# Altium project 100862_project.prjpcb (part 2 of 2)

## Sheet RevisionLog.SchDoc: Revision Log
size 431 x 279 mm; DrawnBy: D. Bruey, M. Ciuffo; Organization: Synapse Product Development, LLC.; Address1: 1511 6th Ave., Suite 400; Address2: Seattle, Washington 98101; Address3: 206.381.0898; Address4: www.synapse.com; DocumentNumber: 17; SheetNumber: 7; SheetTotal: 7; PageSetup: Record=PageOptions|CenterHorizontal=True|CenterVertical=True|PrintScale=1.06|XCorrection=1.00|YCorrection=1.00|PrintKind=1|BorderSize=5000000|LeftOffset=0|BottomOffset=0|Orientation=2|PaperLength=4318|PaperWidth=2794|Scale=100|PaperSource=7|PrintQuality=200|MediaType=1|DitherType=10|PrintScaleMode=1|PaperKind=11x17|PaperIndex=3
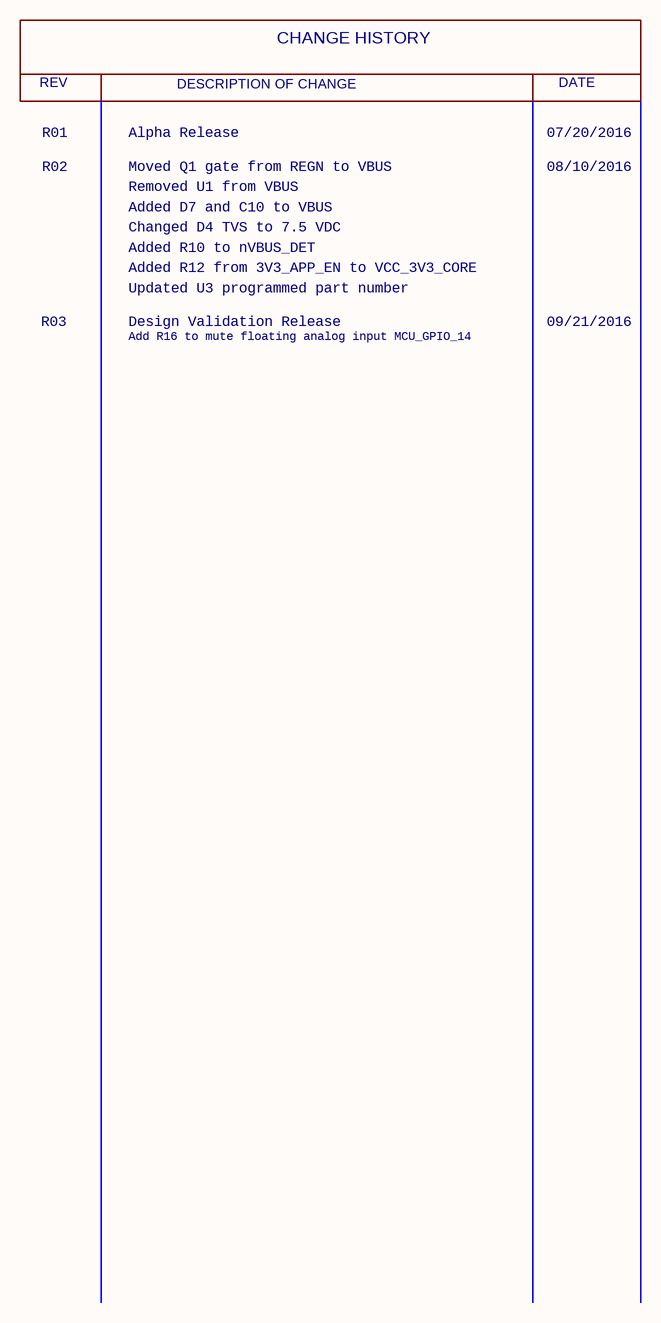
[diagram p6: RevisionLog.SchDoc]

### Notes on the sheet
- REV
- DESCRIPTION OF CHANGE
- CHANGE HISTORY
- DATE
- R01
- R02
- Alpha Release
- Moved Q1 gate from REGN to VBUS
- 07/20/2016
- 08/10/2016
- Removed U1 from VBUS
- Added D7 and C10 to VBUS
- Changed D4 TVS to 7.5 VDC
- Added R10 to nVBUS_DET
- Added R12 from 3V3_APP_EN to VCC_3V3_CORE
- Updated U3 programmed part number
- R03
- Design Validation Release
- Add R16 to mute floating analog input MCU_GPIO_14
- 09/21/2016
- Design Notes:
- Layout Notes:
- Project:
- Sheet Title:
- PCBA:
- PROPRIETARY AND CONFIDENTIAL
- Drawn by:
- Schematic Part Number:
- Schematic Revision:
- Date:
- Sheet:
- /

## Nets that join several sheets
GND: CoreModule (16 pins), Charging (45 pins), Regulation (28 pins), Breakout (35 pins)
USB_VBUS: CoreModule (J8.71), Charging (6 pins)
V_SYS: Charging (10 pins), Regulation (C7.2 R10.1 U3.5 U3.14)
VCC_3V3_APP: Regulation (C72.1 TP92.1 U21.1), Breakout (13 pins)
VCC_3V3_CORE: CoreModule (J8.22 J8.68), Breakout (5 pins)
VCC_3V6: CoreModule (J8.77 J8.79), Regulation (7 pins)
3V3_APP_nEN: CoreModule (J8.40), Regulation (U4.2), Breakout (R12.2 TP36.1)
BATCHG_INT: CoreModule (J8.63), Charging (R78.2 R80.2 TP84.1)
BTN_SYS_CONT: Regulation (S3.2 S3.4 U3.2), Breakout (J2.18)
BTN_SYS_MCU: CoreModule (J8.29), Regulation (U3.10 U3.11), Breakout (TP25.1)
FLEX_A_MISO: CoreModule (J8.51), Breakout (J2.16 TP6.1)
FLEX_A_MOSI: CoreModule (J8.53), Breakout (J2.14 TP5.1)
FLEX_A_SCLK: CoreModule (J8.55), Breakout (J2.26 TP7.1)
FLEX_B_MISO: CoreModule (J8.74), Breakout (J2.6 R153.1 TP13.1)
FLEX_B_MOSI: CoreModule (J8.76), Breakout (J2.8 TP9.1 U28.5)
FLEX_B_SCLK: CoreModule (J8.72), Breakout (J2.4 TP8.1 U28.6)
FLEX_C_MISO: CoreModule (J8.30), Breakout (TP19.1)
FLEX_C_MOSI: CoreModule (J8.28), Breakout (TP18.1)
FLEX_C_SCLK: CoreModule (J8.26), Breakout (TP20.1)
FPGA_GPIO_1: CoreModule (J8.34), Breakout (J2.27 TP3.1)
FPGA_GPIO_2: CoreModule (J8.36), Breakout (J2.28 TP4.1)
FPGA_GPIO_3: CoreModule (J8.38), Breakout (TP32.1)
FPGA_GPIO_5: CoreModule (J8.42), Breakout (TP35.1)
FPGA_GPIO_6: CoreModule (J8.44), Breakout (TP37.1)
FPGA_GPIO_7: CoreModule (J8.46), Breakout (TP33.1)
FPGA_GPIO_8: CoreModule (J8.48), Breakout (R9.2 TP38.1)
FPGA_GPIO_9: CoreModule (J8.50), Breakout (TP34.1)
FPGA_GPIO_10: CoreModule (J8.52), Breakout (TP42.1)
MCU_11/FLASH_NCS: CoreModule (J8.58), Breakout (TP61.1 U2.3)
MCU_GPIO_1: CoreModule (J8.31), Breakout (J2.20 R149.1 TP23.1)
MCU_GPIO_2: CoreModule (J8.33), Breakout (J2.22 R150.1 TP24.1)
MCU_GPIO_4: CoreModule (J8.25), Breakout (D2.C J3.2 TP21.1)
MCU_GPIO_5: CoreModule (J8.27), Breakout (D3.C J3.3 TP22.1)
MCU_GPIO_6: CoreModule (J8.41), Breakout (J2.32 TP28.1)
MCU_GPIO_7: CoreModule (J8.37), Breakout (J2.34 TP29.1)
MCU_GPIO_8: CoreModule (J8.47), Breakout (C2.1 J2.12 R1.1 TP30.1)
MCU_GPIO_9: CoreModule (J8.45), Breakout (J2.10 TP31.1)
MCU_GPIO_10: CoreModule (J8.43), Breakout (J2.19 R151.1 TP60.1)
MCU_GPIO_12: CoreModule (J8.39), Breakout (J2.17 R11.1 TP62.1 U2.1)
MCU_GPIO_13: CoreModule (J8.56), Breakout (J2.1 TP26.1)
MCU_GPIO_14: CoreModule (J8.35), Breakout (J2.24 R16.1 TP27.1)
MCU_nRST: CoreModule (J8.60), Breakout (D1.2 J11.10 TP58.1)
MCU_SWCLK: CoreModule (J8.62), Breakout (J11.4 TP56.1)
MCU_SWDIO: CoreModule (J8.64), Breakout (J11.2 TP55.1)
MCU_SWO: CoreModule (J8.66), Breakout (J11.6 TP57.1)
nVBUS_DET: Charging (Q1.D), Regulation (R10.2 U3.3)
RADIO_GPIO_1: CoreModule (J8.1), Breakout (R2.1 TP2.1)
RADIO_GPIO_2: CoreModule (J8.3), Breakout (R3.1 TP43.1)
RADIO_GPIO_3: CoreModule (J8.5), Breakout (R4.1 TP44.1)
RADIO_GPIO_4: CoreModule (J8.7), Breakout (TP45.1)
RADIO_GPIO_5: CoreModule (J8.9), Breakout (TP46.1)
RADIO_GPIO_6: CoreModule (J8.11), Breakout (TP47.1)
RADIO_GPIO_7: CoreModule (J8.13), Breakout (TP48.1)
RADIO_GPIO_8: CoreModule (J8.15), Breakout (TP49.1)
RADIO_nRST: CoreModule (J8.18), Breakout (D1.1 J4.10 TP53.1)
RADIO_SWCLK: CoreModule (J8.16), Breakout (J4.4 TP51.1)
RADIO_SWDIO: CoreModule (J8.14), Breakout (J4.2 TP50.1)
RADIO_SWO: CoreModule (J8.20), Breakout (J4.6 TP52.1)
SCL: CoreModule (J8.59), Charging (TP79.1 U15.5 U17.A3)
SDA: CoreModule (J8.61), Charging (TP80.1 U15.6 U17.B3)
USB_D_N: CoreModule (J8.69), Charging (J19.2 U1.3 U1.4 U15.3)
USB_D_P: CoreModule (J8.67), Charging (J19.3 U1.1 U1.6 U15.2)

## Assembly variants
100862: not fitted R11 R76 R83
HMD_and_Controller: not fitted R76 R83 U2